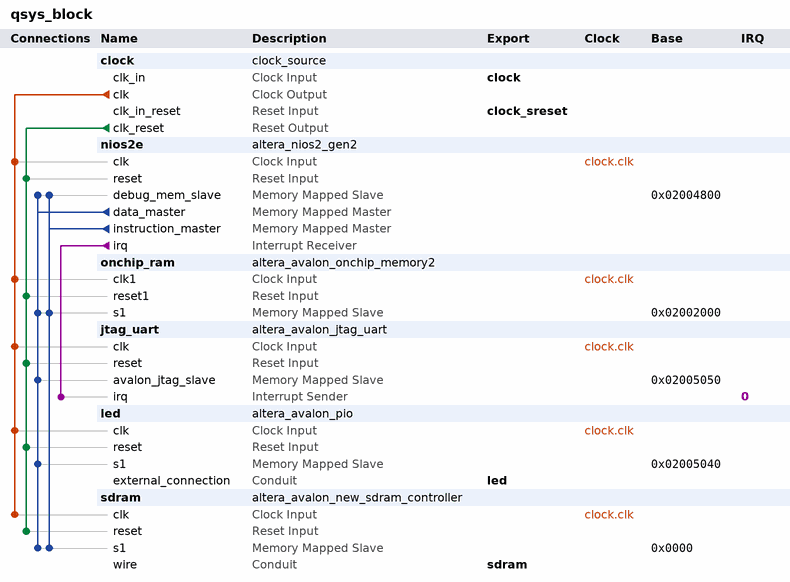
[diagram p0: system contents]
# Platform Designer (Qsys) system qsys_block, Cyclone IV E EP4CE22F17C6
# Parameters at their usual value, and those the tool derives, are not listed.
package require -exact qsys 20.1
create_system qsys_block
set_project_property DEVICE_FAMILY {Cyclone IV E}
set_project_property DEVICE EP4CE22F17C6

add_instance clock clock_source 20.1
set_instance_parameter_value clock clockFrequency 100000000
set_instance_parameter_value clock resetSynchronousEdges BOTH

add_instance nios2e altera_nios2_gen2 20.1
set_instance_parameter_value nios2e dcache_size 2048
set_instance_parameter_value nios2e exceptionSlave onchip_ram.s1
set_instance_parameter_value nios2e icache_size 4096
set_instance_parameter_value nios2e impl Tiny
set_instance_parameter_value nios2e resetSlave onchip_ram.s1
set_instance_parameter_value nios2e setting_activateTrace true

add_instance onchip_ram altera_avalon_onchip_memory2 20.1
set_instance_parameter_value onchip_ram dataWidth 32
set_instance_parameter_value onchip_ram dualPort false
set_instance_parameter_value onchip_ram initMemContent true
set_instance_parameter_value onchip_ram initializationFileName onchip_mem.hex
set_instance_parameter_value onchip_ram memorySize 8192

add_instance jtag_uart altera_avalon_jtag_uart 20.1
set_instance_parameter_value jtag_uart simInteractiveOptions NO_INTERACTIVE_WINDOWS

add_instance led altera_avalon_pio 20.1
set_instance_parameter_value led direction Output
set_instance_parameter_value led width 8

add_instance sdram altera_avalon_new_sdram_controller 20.1
set_instance_parameter_value sdram TAC 5.5
set_instance_parameter_value sdram TRCD 20.0
set_instance_parameter_value sdram TRP 20.0
set_instance_parameter_value sdram casLatency 3
set_instance_parameter_value sdram columnWidth 9
set_instance_parameter_value sdram dataWidth 16
set_instance_parameter_value sdram generateSimulationModel false
set_instance_parameter_value sdram initRefreshCommands 8
set_instance_parameter_value sdram model single_Micron_MT48LC4M32B2_7_chip
set_instance_parameter_value sdram numberOfBanks 4
set_instance_parameter_value sdram numberOfChipSelects 1
set_instance_parameter_value sdram powerUpDelay 200.0
set_instance_parameter_value sdram refreshPeriod 7.8125
set_instance_parameter_value sdram rowWidth 13

# connections
add_connection clock.clk jtag_uart.clk clock
add_connection clock.clk led.clk clock
add_connection clock.clk nios2e.clk clock
add_connection clock.clk onchip_ram.clk1 clock
add_connection clock.clk sdram.clk clock
add_connection clock.clk_reset jtag_uart.reset reset
add_connection clock.clk_reset led.reset reset
add_connection clock.clk_reset nios2e.reset reset
add_connection clock.clk_reset onchip_ram.reset1 reset
add_connection clock.clk_reset sdram.reset reset
add_connection nios2e.data_master jtag_uart.avalon_jtag_slave avalon
set_connection_parameter_value nios2e.data_master/jtag_uart.avalon_jtag_slave baseAddress 0x02005050
add_connection nios2e.data_master led.s1 avalon
set_connection_parameter_value nios2e.data_master/led.s1 baseAddress 0x02005040
add_connection nios2e.data_master nios2e.debug_mem_slave avalon
set_connection_parameter_value nios2e.data_master/nios2e.debug_mem_slave baseAddress 0x02004800
add_connection nios2e.data_master onchip_ram.s1 avalon
set_connection_parameter_value nios2e.data_master/onchip_ram.s1 baseAddress 0x02002000
add_connection nios2e.data_master sdram.s1 avalon
set_connection_parameter_value nios2e.data_master/sdram.s1 baseAddress 0x0000
add_connection nios2e.instruction_master nios2e.debug_mem_slave avalon
set_connection_parameter_value nios2e.instruction_master/nios2e.debug_mem_slave baseAddress 0x02004800
add_connection nios2e.instruction_master onchip_ram.s1 avalon
set_connection_parameter_value nios2e.instruction_master/onchip_ram.s1 baseAddress 0x02002000
add_connection nios2e.instruction_master sdram.s1 avalon
set_connection_parameter_value nios2e.instruction_master/sdram.s1 baseAddress 0x0000
add_connection nios2e.irq jtag_uart.irq interrupt
set_connection_parameter_value nios2e.irq/jtag_uart.irq irqNumber 0

# exported interfaces
add_interface clock clock sink
set_interface_property clock EXPORT_OF clock.clk_in
add_interface clock_sreset reset sink
set_interface_property clock_sreset EXPORT_OF clock.clk_in_reset
add_interface led conduit end
set_interface_property led EXPORT_OF led.external_connection
add_interface sdram conduit end
set_interface_property sdram EXPORT_OF sdram.wire

set_interconnect_requirement {$system} qsys_mm.clockCrossingAdapter HANDSHAKE
set_interconnect_requirement {$system} qsys_mm.maxAdditionalLatency 1

save_system qsys_block.qsys
